# Altium schematic sheet HANC1.0_SCH.SchDoc
size B
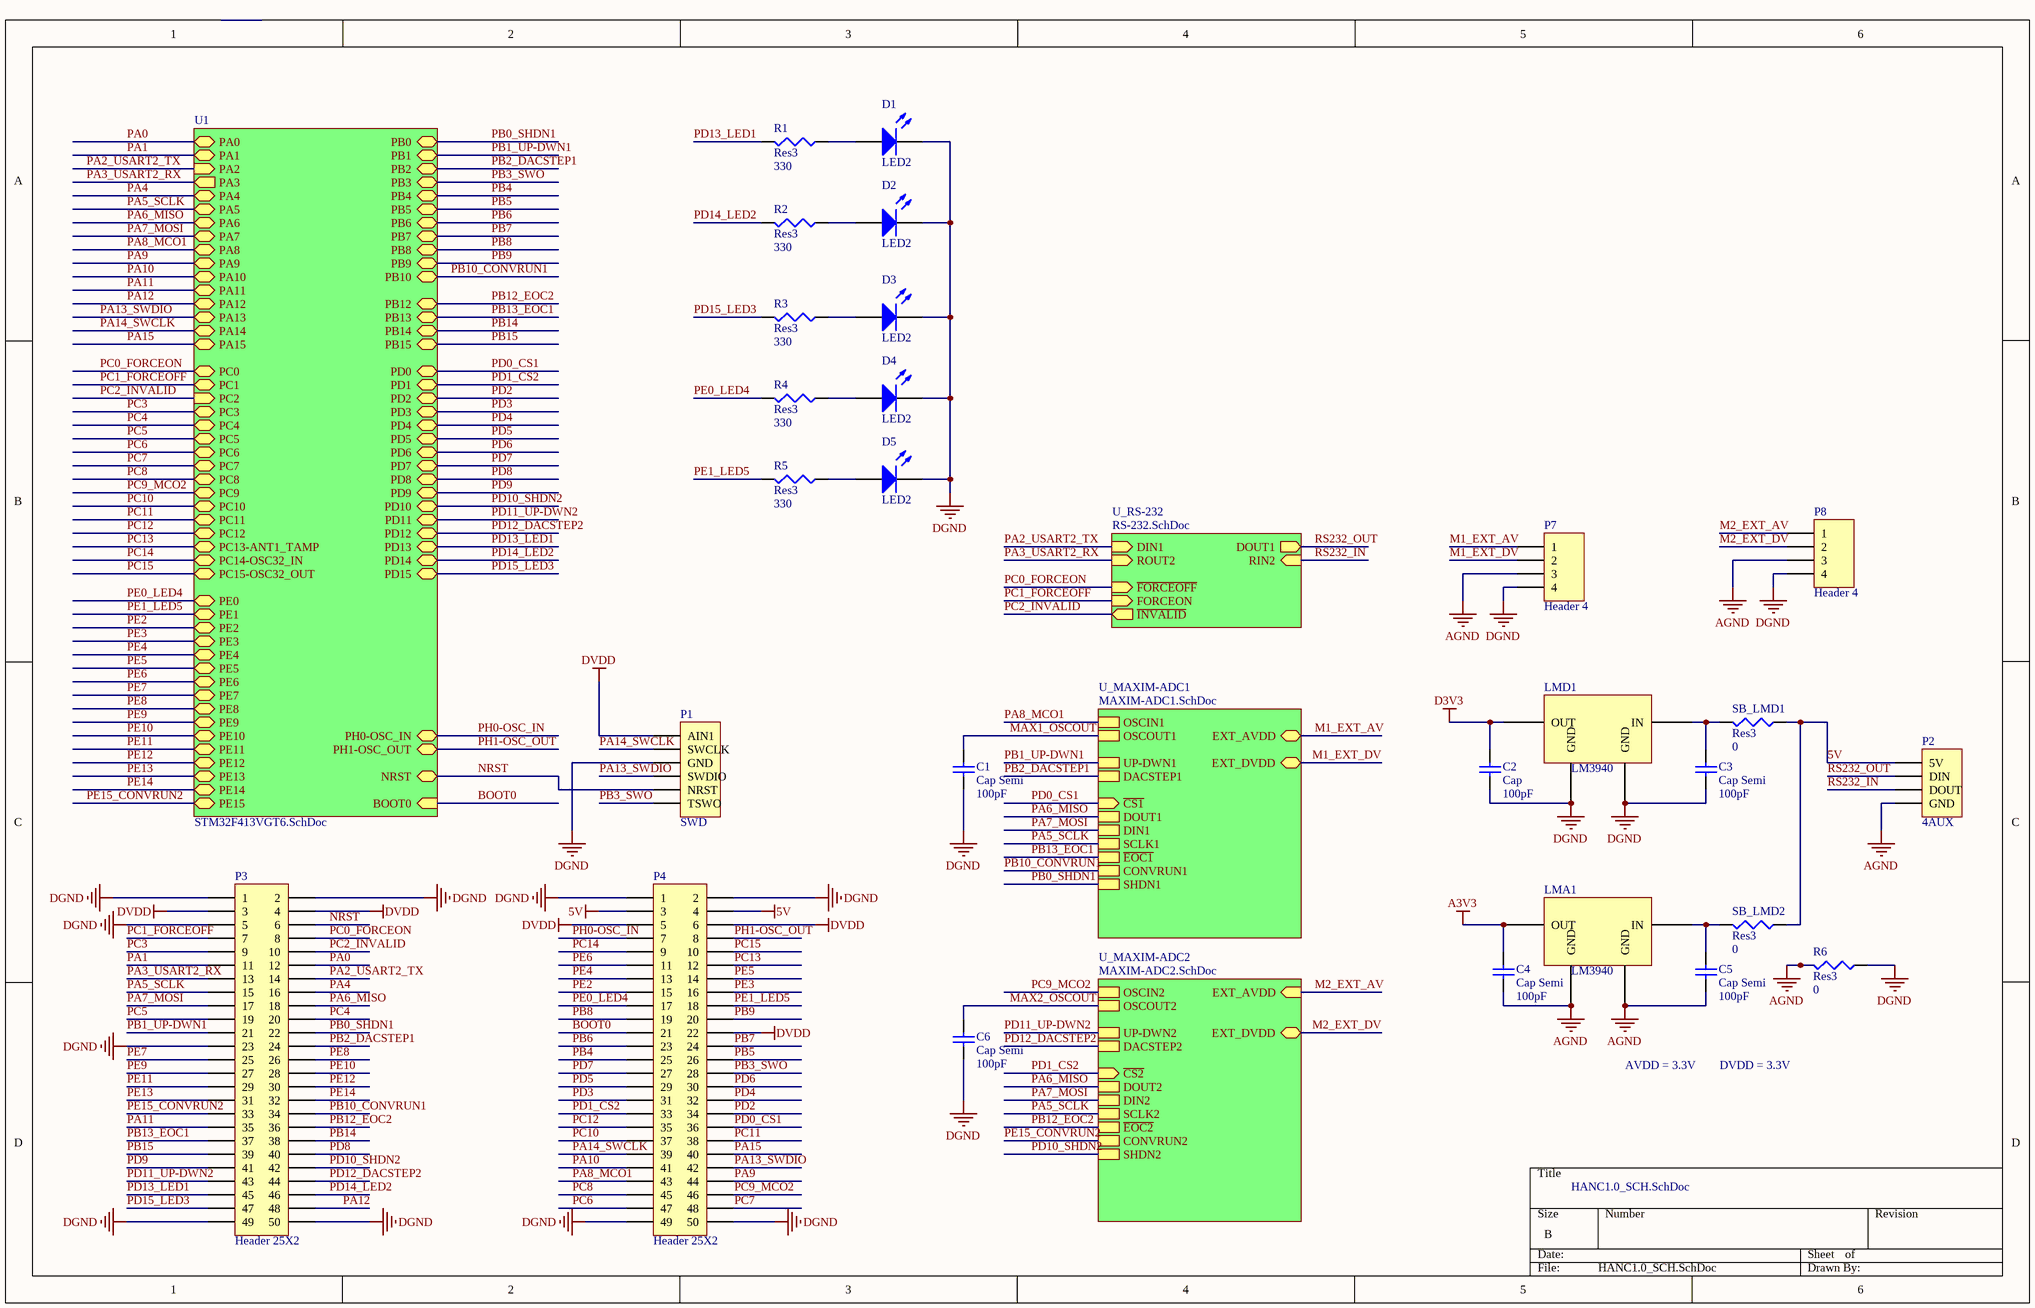
[diagram p0: HANC1.0_SCH.SchDoc]

## Parts
C1  Cap Semi  value 100pF  [1608[0603]]
C2  Cap  value 100pF  [1608[0603]]
C3  Cap Semi  value 100pF  [1608[0603]]
C4  Cap Semi  value 100pF  [1608[0603]]
C5  Cap Semi  value 100pF  [1608[0603]]
C6  Cap Semi  value 100pF  [1608[0603]]
D1  LED2  [3.2X1.6X1.1]
D2  LED2  [3.2X1.6X1.1]
D3  LED2  [3.2X1.6X1.1]
D4  LED2  [3.2X1.6X1.1]
D5  LED2  [3.2X1.6X1.1]
LMA1  LM3940  [SOT223_N]
LMD1  LM3940  [SOT223_N]
P1  SWD  [HDR1X6]
P2  4AUX  [HDR1X4]
P3  Header 25X2  [HDR2X25]
P4  Header 25X2  [HDR2X25]
P7  Header 4  [HDR1X4]
P8  Header 4  [HDR1X4]
R1  Res3  value 330  [J1-0603]
R2  Res3  value 330  [J1-0603]
R3  Res3  value 330  [J1-0603]
R4  Res3  value 330  [J1-0603]
R5  Res3  value 330  [J1-0603]
R6  Res3  value 0  [J1-0603]
SB_LMD1  Res3  value 0  [J1-0603]
SB_LMD2  Res3  value 0  [J1-0603]

## Sub-sheets
U1 = STM32F413VGT6.SchDoc: PE2 (bidir), PH0-OSC_IN (bidir), PH1-OSC_OUT (bidir), NRST (bidir), PC0 (bidir), PC1 (bidir), PC2 (in), PC3 (bidir), PE3 (bidir), PA0 (bidir), PA1 (bidir), PA2 (in), PA3 (out), PA4 (bidir), PE4 (bidir), PA5 (bidir), PA6 (bidir), PA7 (bidir), PC4 (bidir), PC5 (bidir), PB0 (bidir), PB1 (bidir), PB2 (bidir), PE7 (bidir), PE8 (bidir), PE5 (bidir), PE9 (bidir), PE10 (bidir), PE11 (bidir), PE12 (bidir), PE13 (bidir), PE14 (bidir), PE15 (bidir), PB10 (bidir), PE6 (bidir), PB12 (bidir), PB13 (bidir), PB14 (bidir), PB15 (bidir), PD8 (bidir), PD9 (bidir), PD10 (bidir), PD11 (bidir), PD12 (bidir), PD13 (bidir), PD14 (bidir), PD15 (bidir), PC6 (bidir), PC7 (bidir), PC8 (bidir), PC9 (bidir), PA8 (bidir), PA9 (bidir), PA10 (bidir), PC13-ANT1_TAMP (bidir), PA11 (bidir), PA12 (bidir), PA13 (bidir), PA14 (bidir), PA15 (bidir), PC10 (bidir), PC11 (bidir), PC14-OSC32_IN (bidir), PC12 (bidir), PD0 (bidir), PD1 (bidir), PD2 (bidir), PD3 (bidir), PD4 (bidir), PD5 (bidir), PD6 (bidir), PD7 (bidir), PB3 (bidir), PC15-OSC32_OUT (bidir), PB4 (bidir), PB5 (bidir), PB6 (bidir), PB7 (bidir), BOOT0, PB8 (bidir), PB9 (bidir), PE0 (bidir), PE1 (bidir)
U_MAXIM-ADC1 = MAXIM-ADC1.SchDoc: OSCIN1, OSCOUT1, UP-DWN1, DACSTEP1, ~{CS1} (in), DOUT1, DIN1, SCLK1, ~{EOC1}, CONVRUN1, SHDN1, EXT_AVDD, EXT_DVDD
U_MAXIM-ADC2 = MAXIM-ADC2.SchDoc: OSCIN2, OSCOUT2, UP-DWN2, DACSTEP2, ~{CS2} (in), DOUT2, DIN2, SCLK2, ~{EOC2}, CONVRUN2, SHDN2, EXT_AVDD (in), EXT_DVDD
U_RS-232 = RS-232.SchDoc: DIN1 (in), RIN2 (in), ~{FORCEOFF} (in), FORCEON (in), DOUT1 (out), ROUT2 (in), ~{INVALID} (out)

## Nets
5V: P2.1(5V) P4.3 P4.4 SB_LMD1.1 SB_LMD2.1
A3V3: C4.2 LMA1.3(OUT)
AGND: C4.1 C5.1 LMA1.2(GND) LMA1.4(GND) P2.4(GND) P7.3 P8.3 R6.2
D3V3: C2.2 LMD1.3(OUT)
DGND: C1.1 C2.1 C3.1 C6.1 D1.2(K) D2.2(K) D3.2(K) D4.2(K) D5.2(K) LMD1.2(GND) LMD1.4(GND) P1.3(GND) P3.1 P3.2 P3.5 P3.23 P3.49 P3.50 P4.1 P4.2 P4.49 P4.50 P7.4 P8.4 R6.1
DVDD: P1.1(AIN1) P3.3 P3.4 P4.5 P4.6 P4.22
BOOT0: P4.21 ; sheet U1/BOOT0
M1_EXT_AV: P7.1 ; sheet U_MAXIM-ADC1/EXT_AVDD
M1_EXT_DV: P7.2 ; sheet U_MAXIM-ADC1/EXT_DVDD
M2_EXT_AV: P8.1 ; sheet U_MAXIM-ADC2/EXT_AVDD
M2_EXT_DV: P8.2 ; sheet U_MAXIM-ADC2/EXT_DVDD
MAX1_OSCOUT: C1.2 ; sheet U_MAXIM-ADC1/OSCOUT1
MAX2_OSCOUT: C6.2 ; sheet U_MAXIM-ADC2/OSCOUT2
NRST: P1.5(NRST) P3.6 ; sheet U1/NRST
PA0: P3.12 ; sheet U1/PA0
PA1: P3.11 ; sheet U1/PA1
PA2_USART2_TX: P3.14 ; sheet U1/PA2, sheet U_RS-232/DIN1
PA3_USART2_RX: P3.13 ; sheet U1/PA3, sheet U_RS-232/ROUT2
PA4: P3.16 ; sheet U1/PA4
PA5_SCLK: P3.15 ; sheet U1/PA5, sheet U_MAXIM-ADC2/SCLK2, sheet U_MAXIM-ADC1/SCLK1
PA6_MISO: P3.18 ; sheet U1/PA6, sheet U_MAXIM-ADC2/DOUT2, sheet U_MAXIM-ADC1/DOUT1
PA7_MOSI: P3.17 ; sheet U1/PA7, sheet U_MAXIM-ADC2/DIN2, sheet U_MAXIM-ADC1/DIN1
PA8_MCO1: P4.43 ; sheet U1/PA8, sheet U_MAXIM-ADC1/OSCIN1
PA9: P4.44 ; sheet U1/PA9
PA10: P4.41 ; sheet U1/PA10
PA11: P3.35 ; sheet U1/PA11
PA12: P3.48 ; sheet U1/PA12
PA13_SWDIO: P1.4(SWDIO) P4.42 ; sheet U1/PA13
PA14_SWCLK: P1.2(SWCLK) P4.39 ; sheet U1/PA14
PA15: P4.40 ; sheet U1/PA15
PB0_SHDN1: P3.22 ; sheet U1/PB0, sheet U_MAXIM-ADC1/SHDN1
PB1_UP-DWN1: P3.21 ; sheet U1/PB1, sheet U_MAXIM-ADC1/UP-DWN1
PB2_DACSTEP1: P3.24 ; sheet U1/PB2, sheet U_MAXIM-ADC1/DACSTEP1
PB3_SWO: P1.6(TSWO) P4.28 ; sheet U1/PB3
PB4: P4.25 ; sheet U1/PB4
PB5: P4.26 ; sheet U1/PB5
PB6: P4.23 ; sheet U1/PB6
PB7: P4.24 ; sheet U1/PB7
PB8: P4.19 ; sheet U1/PB8
PB9: P4.20 ; sheet U1/PB9
PB10_CONVRUN1: P3.34 ; sheet U1/PB10, sheet U_MAXIM-ADC1/CONVRUN1
PB12_EOC2: P3.36 ; sheet U1/PB12, sheet U_MAXIM-ADC2/~{EOC2}
PB13_EOC1: P3.37 ; sheet U1/PB13, sheet U_MAXIM-ADC1/~{EOC1}
PB14: P3.38 ; sheet U1/PB14
PB15: P3.39 ; sheet U1/PB15
PC0_FORCEON: P3.8 ; sheet U1/PC0, sheet U_RS-232/~{FORCEOFF}
PC1_FORCEOFF: P3.7 ; sheet U1/PC1, sheet U_RS-232/FORCEON
PC2_INVALID: P3.10 ; sheet U1/PC2, sheet U_RS-232/~{INVALID}
PC3: P3.9 ; sheet U1/PC3
PC4: P3.20 ; sheet U1/PC4
PC5: P3.19 ; sheet U1/PC5
PC6: P4.47 ; sheet U1/PC6
PC7: P4.48 ; sheet U1/PC7
PC8: P4.45 ; sheet U1/PC8
PC9_MCO2: P4.46 ; sheet U1/PC9, sheet U_MAXIM-ADC2/OSCIN2
PC10: P4.37 ; sheet U1/PC10
PC11: P4.38 ; sheet U1/PC11
PC12: P4.35 ; sheet U1/PC12
PC13: P4.12 ; sheet U1/PC13-ANT1_TAMP
PC14: P4.9 ; sheet U1/PC14-OSC32_IN
PC15: P4.10 ; sheet U1/PC15-OSC32_OUT
PD0_CS1: P4.36 ; sheet U1/PD0, sheet U_MAXIM-ADC1/~{CS1}
PD1_CS2: P4.33 ; sheet U1/PD1, sheet U_MAXIM-ADC2/~{CS2}
PD2: P4.34 ; sheet U1/PD2
PD3: P4.31 ; sheet U1/PD3
PD4: P4.32 ; sheet U1/PD4
PD5: P4.29 ; sheet U1/PD5
PD6: P4.30 ; sheet U1/PD6
PD7: P4.27 ; sheet U1/PD7
PD8: P3.40 ; sheet U1/PD8
PD9: P3.41 ; sheet U1/PD9
PD10_SHDN2: P3.42 ; sheet U1/PD10, sheet U_MAXIM-ADC2/SHDN2
PD11_UP-DWN2: P3.43 ; sheet U1/PD11, sheet U_MAXIM-ADC2/UP-DWN2
PD12_DACSTEP2: P3.44 ; sheet U1/PD12, sheet U_MAXIM-ADC2/DACSTEP2
PD13_LED1: P3.45 R1.2 ; sheet U1/PD13
PD14_LED2: P3.46 R2.2 ; sheet U1/PD14
PD15_LED3: P3.47 R3.2 ; sheet U1/PD15
PE0_LED4: P4.17 R4.2 ; sheet U1/PE0
PE1_LED5: P4.18 R5.2 ; sheet U1/PE1
PE2: P4.15 ; sheet U1/PE2
PE3: P4.16 ; sheet U1/PE3
PE4: P4.13 ; sheet U1/PE4
PE5: P4.14 ; sheet U1/PE5
PE6: P4.11 ; sheet U1/PE6
PE7: P3.25 ; sheet U1/PE7
PE8: P3.26 ; sheet U1/PE8
PE9: P3.27 ; sheet U1/PE9
PE10: P3.28 ; sheet U1/PE10
PE11: P3.29 ; sheet U1/PE11
PE12: P3.30 ; sheet U1/PE12
PE13: P3.31 ; sheet U1/PE13
PE14: P3.32 ; sheet U1/PE14
PE15_CONVRUN2: P3.33 ; sheet U1/PE15, sheet U_MAXIM-ADC2/CONVRUN2
PH0-OSC_IN: P4.7 ; sheet U1/PH0-OSC_IN
PH1-OSC_OUT: P4.8 ; sheet U1/PH1-OSC_OUT
RS232_IN: P2.3(DOUT) ; sheet U_RS-232/RIN2
RS232_OUT: P2.2(DIN) ; sheet U_RS-232/DOUT1
NetC3_2: C3.2 LMD1.1(IN) SB_LMD1.2
NetC5_2: C5.2 LMA1.1(IN) SB_LMD2.2
NetD1_1: D1.1(A) R1.1
NetD2_1: D2.1(A) R2.1
NetD3_1: D3.1(A) R3.1
NetD4_1: D4.1(A) R4.1
NetD5_1: D5.1(A) R5.1

## Notes on the sheet
- AVDD = 3.3V
- DVDD = 3.3V

## Library data of the parts
C1-C6 = Cap Semi: Capacitor (Semiconductor SIM Model); Published: 8-Jun-2000; LatestRevisionDate: 29-May-2009; LatestRevisionNote: IPC-7351 Footprint Added.; PackageReference: C1206; Publisher: Altium Limited; PackageDescription: Chip Capacitor
D1-D5 = LED2: Typical RED, GREEN, YELLOW, AMBER GaAs LED; Published: 8-Jun-2000; LatestRevisionDate: 17-Jul-2002; LatestRevisionNote: Re-released for DXP Platform.; PackageVersion: Feb-2002; PackageReference: 3.2X1.6X1.1; Publisher: Altium Limited; PackageDescription: SM LED; 2 Flat Leads
LMA1 LMD1 = Component_1
P1 = Header 6: Header, 6-Pin; LatestRevisionDate: 17-Jul-2002; LatestRevisionNote: Re-released for DXP Platform.; Publisher: Altium Limited
P2 P7 P8 = Header 4: Header, 4-Pin; LatestRevisionDate: 17-Jul-2002; LatestRevisionNote: Re-released for DXP Platform.; Publisher: Altium Limited
P3 P4 = Header 25X2: Header, 25-Pin, Dual row; LatestRevisionDate: 17-Jul-2002; LatestRevisionNote: Re-released for DXP Platform.; Publisher: Altium Limited
R1-R6 SB_LMD1 SB_LMD2 = Res3: Resistor; Published: 8-Jun-2000; LatestRevisionDate: 29-May-2009; LatestRevisionNote: IPC-7351 Footprint Added.; PackageReference: J1-0603; Publisher: Altium Limited; PackageDescription: Chip Resistor